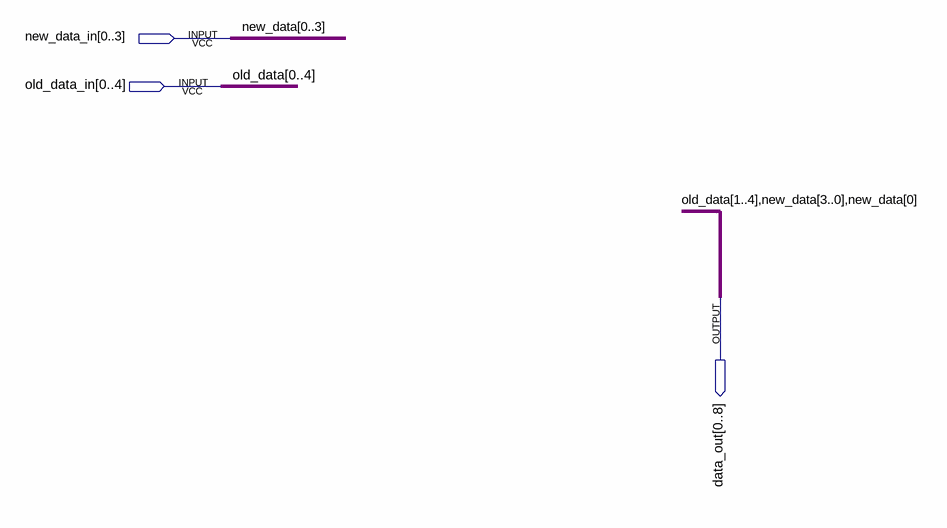
[diagram p0: schematic sheet]
// Quartus schematic bus_combine.bdf as structural Verilog: 0 symbols, 3 pins
module bus_combine (
  input  [0:3] new_data_in,
  input  [0:4] old_data_in,
  output [0:8] data_out
);


  assign data_out = {old_data_in[1:4], new_data_in[3], new_data_in[2], new_data_in[1], {2{new_data_in[0]}}};

  // Other names for the same wires on the sheet: old_data[4:0] = {old_data_in[4], old_data_in[3], old_data_in[2], old_data_in[1], old_data_in[0]};
  //   new_data[3:0] = {new_data_in[3], new_data_in[2], new_data_in[1], new_data_in[0]}
endmodule
